# Altium project SpaceVNXDaughterBoard.PrjPcb
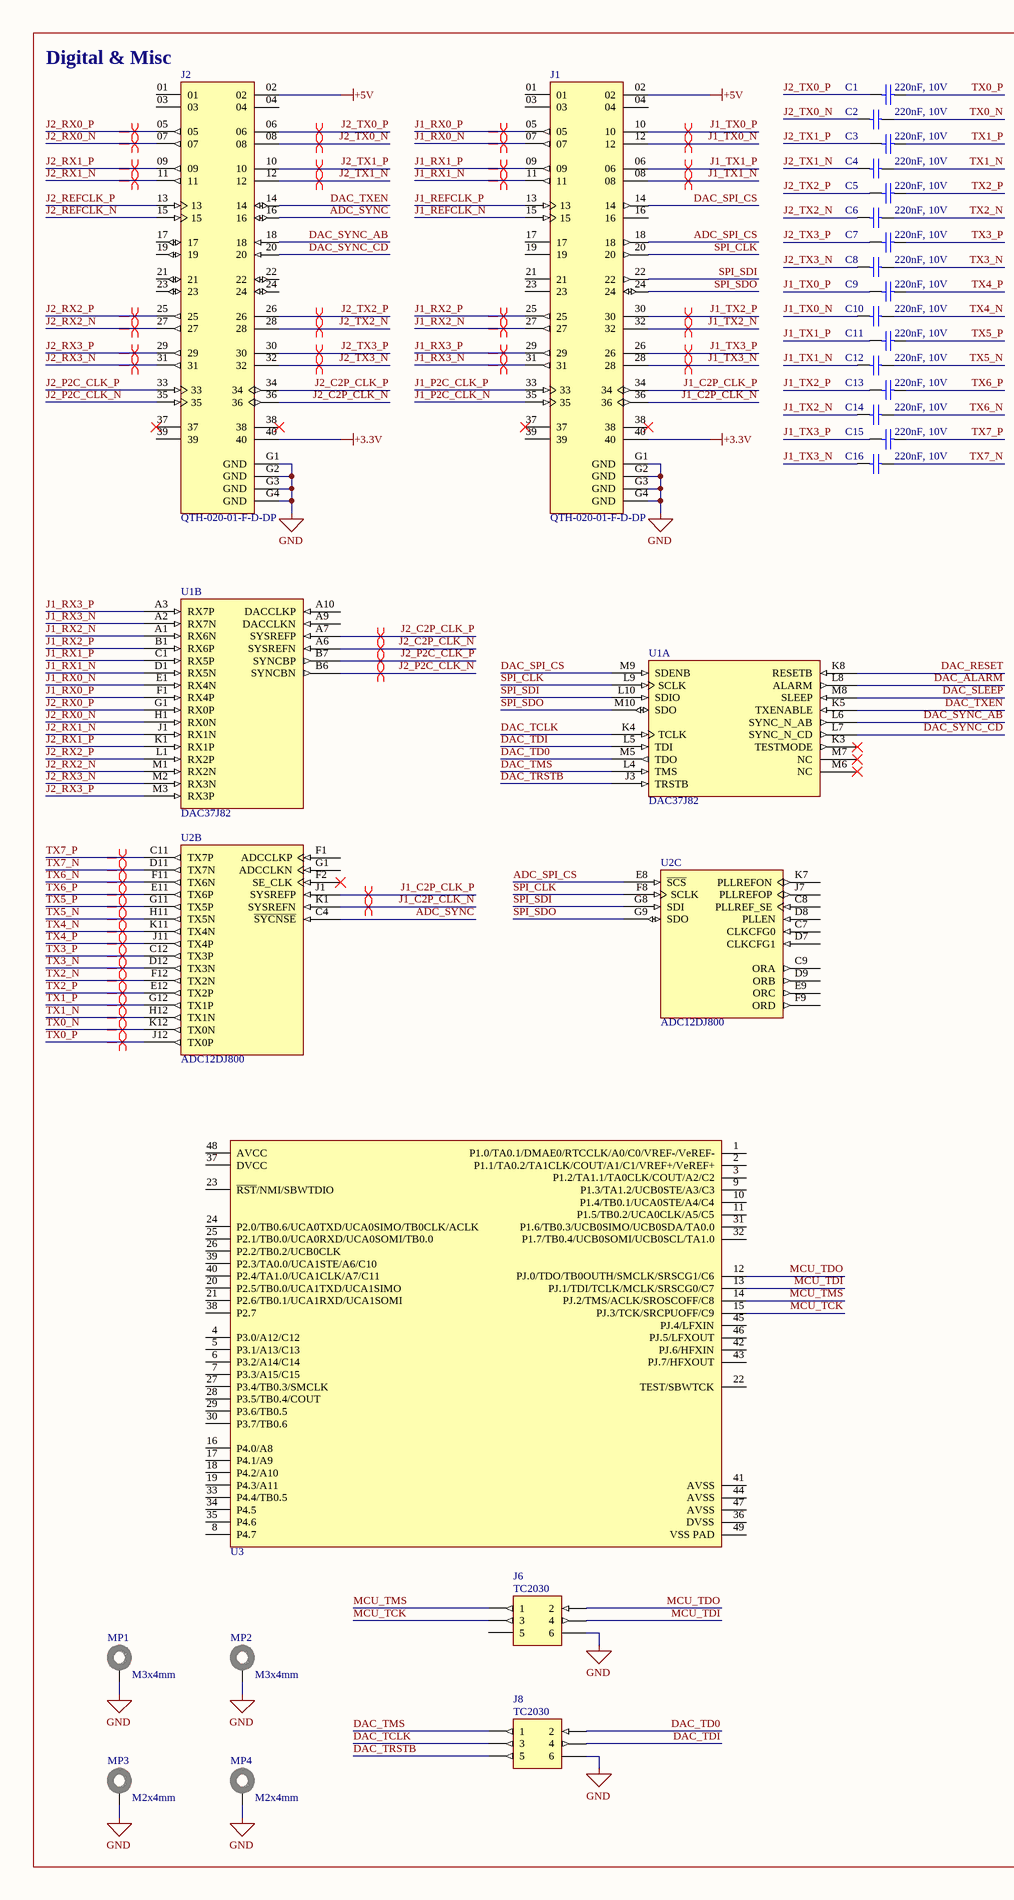
[diagram p0: SpaceVNXDaughterBoard.SchDoc, left]
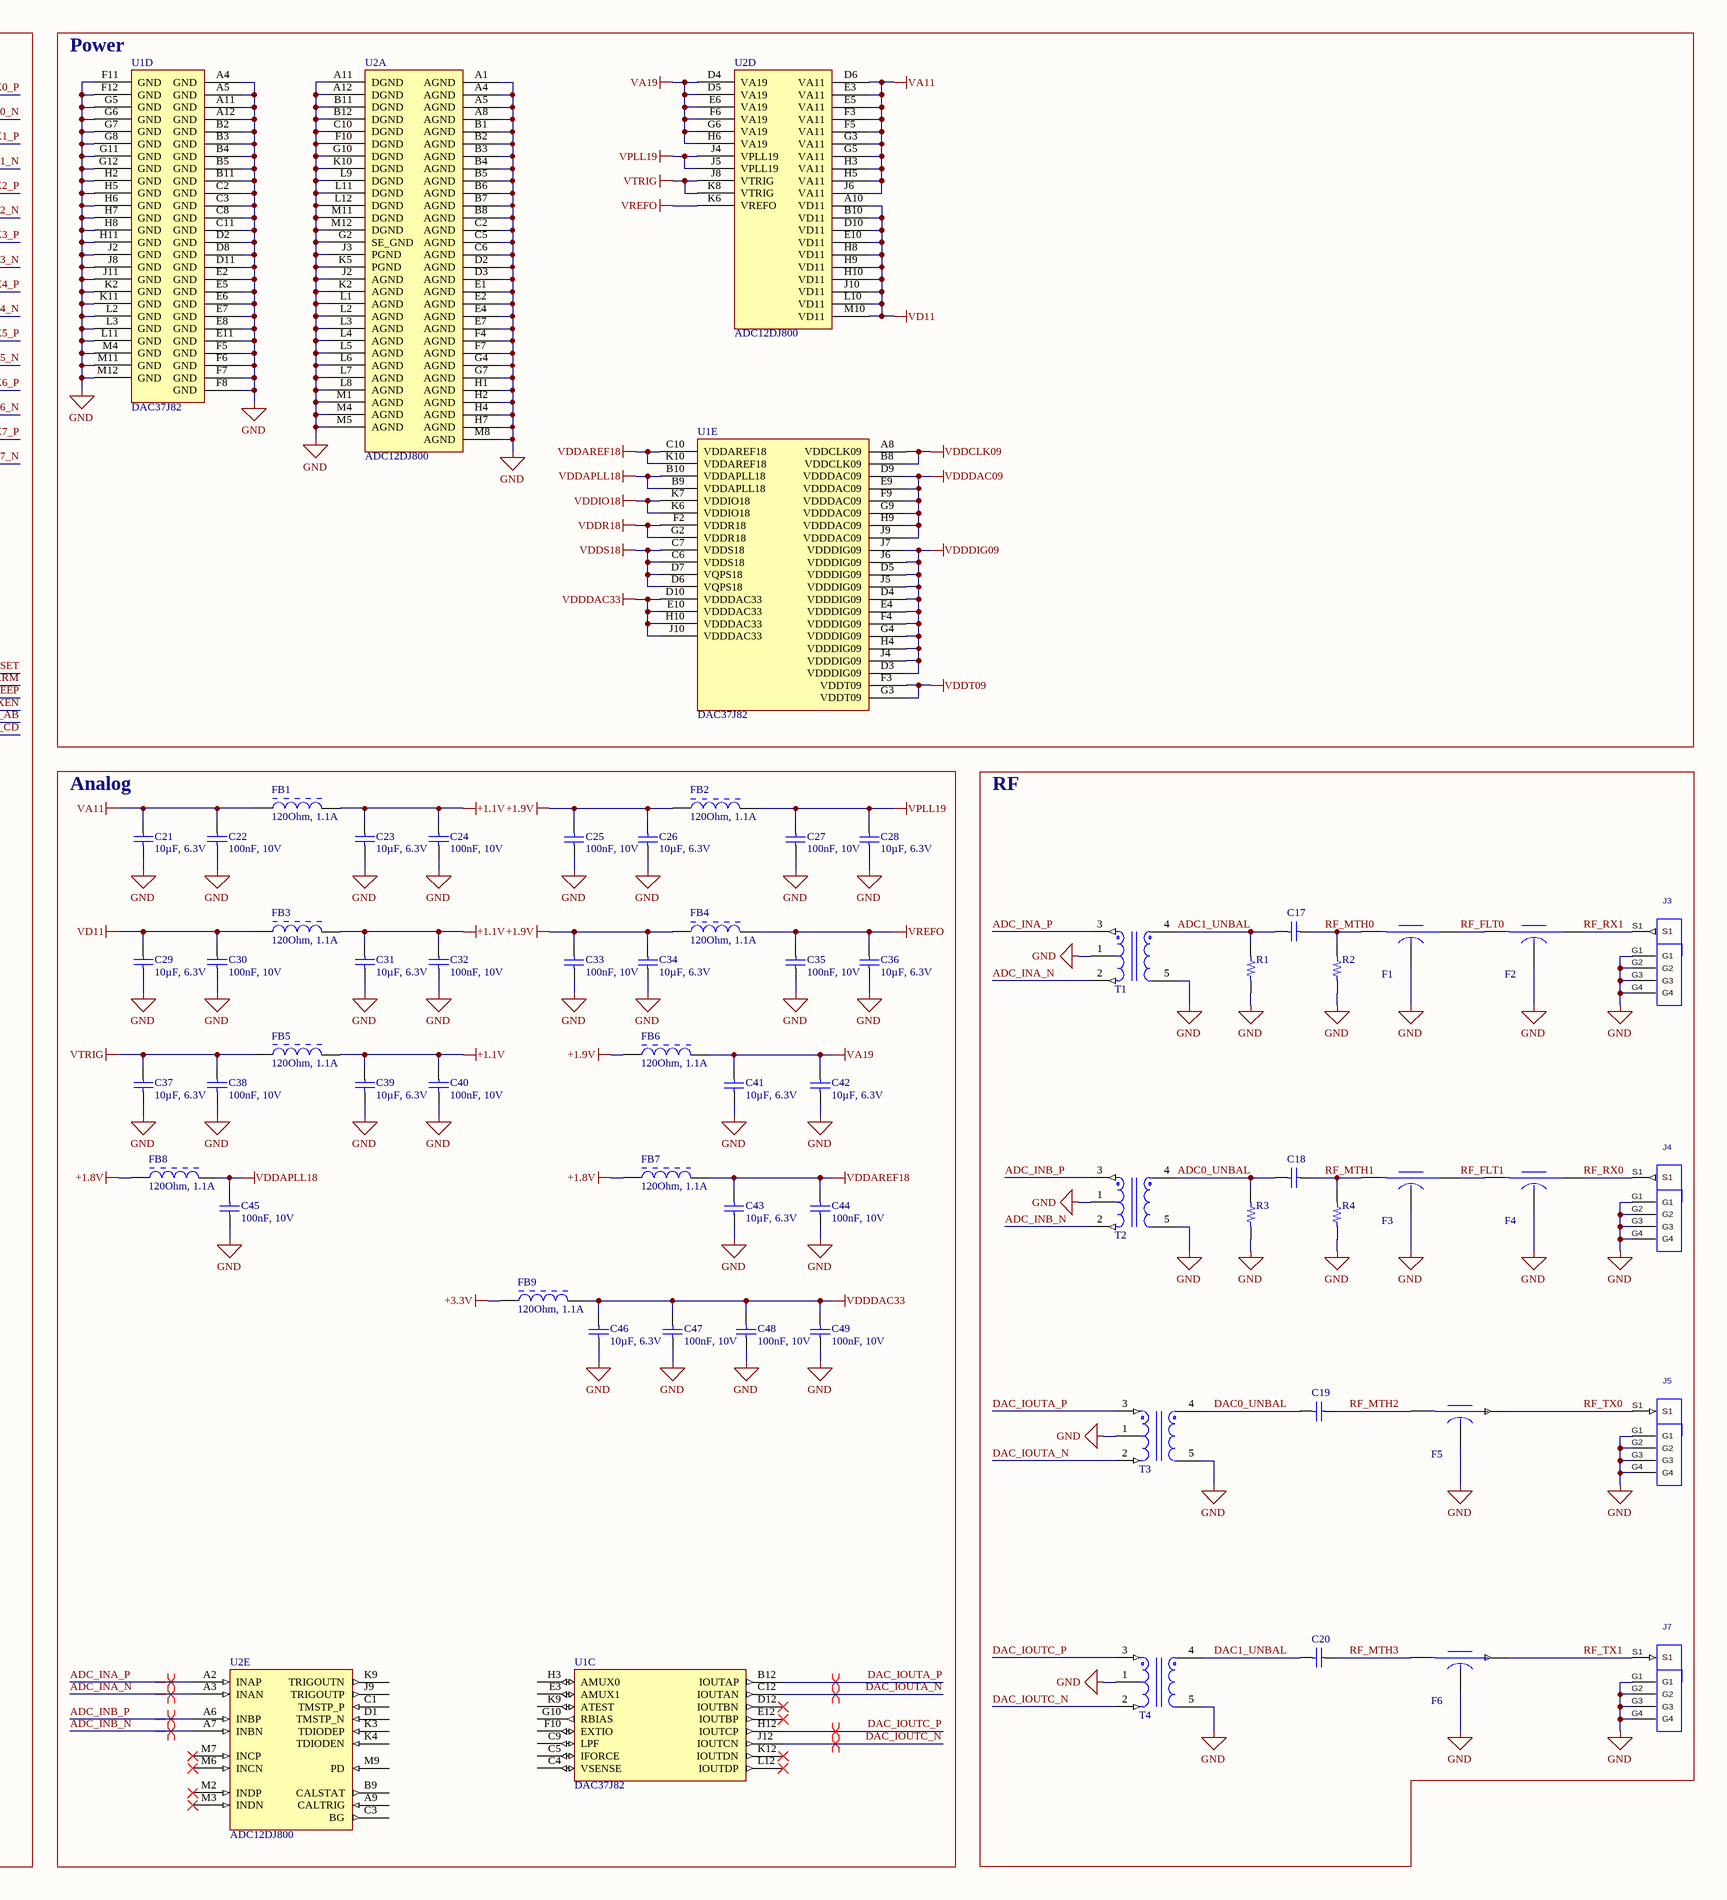
[diagram p1: SpaceVNXDaughterBoard.SchDoc, right]
1 sheet, 87 parts. Net scope: global (net labels, ports and power ports of the same name join across sheets).
Board file: SpaceVNXDaughterBoard.PcbDoc

## Sheet SpaceVNXDaughterBoard.SchDoc: DaughterBoard
size A2; Author: Carlos Barreiro; Organization: Escuela Técnica Superior de Ingeniería de Sistemas Informáticos de la Universidad Politécnica de Madrid; Address1: Campus Sur de la Universidad Politécnica de Madrid; Address2: Calle de Alan Turing, s/nº; Address3: Madrid 28031; Address4: España; DocumentNumber: 1; Revision: 1.0; SheetNumber: 1; SheetTotal: 1

### Parts
C1  220nF, 10V  [WURTH_WCAP-CSGP_0402]
C2  220nF, 10V  [WURTH_WCAP-CSGP_0402]
C3  220nF, 10V  [WURTH_WCAP-CSGP_0402]
C4  220nF, 10V  [WURTH_WCAP-CSGP_0402]
C5  220nF, 10V  [WURTH_WCAP-CSGP_0402]
C6  220nF, 10V  [WURTH_WCAP-CSGP_0402]
C7  220nF, 10V  [WURTH_WCAP-CSGP_0402]
C8  220nF, 10V  [WURTH_WCAP-CSGP_0402]
C9  220nF, 10V  [WURTH_WCAP-CSGP_0402]
C10  220nF, 10V  [WURTH_WCAP-CSGP_0402]
C11  220nF, 10V  [WURTH_WCAP-CSGP_0402]
C12  220nF, 10V  [WURTH_WCAP-CSGP_0402]
C13  220nF, 10V  [WURTH_WCAP-CSGP_0402]
C14  220nF, 10V  [WURTH_WCAP-CSGP_0402]
C15  220nF, 10V  [WURTH_WCAP-CSGP_0402]
C16  220nF, 10V  [WURTH_WCAP-CSGP_0402]
C17  10pF, 16V  [WURTH_WCAP-CSGP_0402]  (value not drawn)
C18  10pF, 16V  [WURTH_WCAP-CSGP_0402]  (value not drawn)
C19  10pF, 16V  [WURTH_WCAP-CSGP_0402]  (value not drawn)
C20  10pF, 16V  [WURTH_WCAP-CSGP_0402]  (value not drawn)
C21  10µF, 6.3V  [WURTH_WCAP-CSGP_0402]
C22  100nF, 10V  [WURTH_WCAP-CSGP_0402]
C23  10µF, 6.3V  [WURTH_WCAP-CSGP_0402]
C24  100nF, 10V  [WURTH_WCAP-CSGP_0402]
C25  100nF, 10V  [WURTH_WCAP-CSGP_0402]
C26  10µF, 6.3V  [WURTH_WCAP-CSGP_0402]
C27  100nF, 10V  [WURTH_WCAP-CSGP_0402]
C28  10µF, 6.3V  [WURTH_WCAP-CSGP_0402]
C29  10µF, 6.3V  [WURTH_WCAP-CSGP_0402]
C30  100nF, 10V  [WURTH_WCAP-CSGP_0402]
C31  10µF, 6.3V  [WURTH_WCAP-CSGP_0402]
C32  100nF, 10V  [WURTH_WCAP-CSGP_0402]
C33  100nF, 10V  [WURTH_WCAP-CSGP_0402]
C34  10µF, 6.3V  [WURTH_WCAP-CSGP_0402]
C35  100nF, 10V  [WURTH_WCAP-CSGP_0402]
C36  10µF, 6.3V  [WURTH_WCAP-CSGP_0402]
C37  10µF, 6.3V  [WURTH_WCAP-CSGP_0402]
C38  100nF, 10V  [WURTH_WCAP-CSGP_0402]
C39  10µF, 6.3V  [WURTH_WCAP-CSGP_0402]
C40  100nF, 10V  [WURTH_WCAP-CSGP_0402]
C41  10µF, 6.3V  [WURTH_WCAP-CSGP_0402]
C42  10µF, 6.3V  [WURTH_WCAP-CSGP_0402]
C43  10µF, 6.3V  [WURTH_WCAP-CSGP_0402]
C44  100nF, 10V  [WURTH_WCAP-CSGP_0402]
C45  100nF, 10V  [WURTH_WCAP-CSGP_0402]
C46  10µF, 6.3V  [WURTH_WCAP-CSGP_0402]
C47  100nF, 10V  [WURTH_WCAP-CSGP_0402]
C48  100nF, 10V  [WURTH_WCAP-CSGP_0402]
C49  100nF, 10V  [WURTH_WCAP-CSGP_0402]
F1  BFTC-XXXX+  [Mini-Circuits_FV1206]  (value not drawn)
F2  BFTC-XXXX+  [Mini-Circuits_FV1206]  (value not drawn)
F3  BFTC-XXXX+  [Mini-Circuits_FV1206]  (value not drawn)
F4  BFTC-XXXX+  [Mini-Circuits_FV1206]  (value not drawn)
F5  BFTC-XXXX+  [Mini-Circuits_FV1206]  (value not drawn)
F6  BFTC-XXXX+  [Mini-Circuits_FV1206]  (value not drawn)
FB1  120Ohm, 1.1A  [WURTH-CBF_0402]
FB2  120Ohm, 1.1A  [WURTH-CBF_0402]
FB3  120Ohm, 1.1A  [WURTH-CBF_0402]
FB4  120Ohm, 1.1A  [WURTH-CBF_0402]
FB5  120Ohm, 1.1A  [WURTH-CBF_0402]
FB6  120Ohm, 1.1A  [WURTH-CBF_0402]
FB7  120Ohm, 1.1A  [WURTH-CBF_0402]
FB8  120Ohm, 1.1A  [WURTH-CBF_0402]
FB9  120Ohm, 1.1A  [WURTH-CBF_0402]
J1  QTH-020-01-F-D-DP  [SAMTEC_QTH-020-01-X-D-DP-A]
J2  QTH-020-01-F-D-DP  [SAMTEC_QTH-020-01-X-D-DP-A]
J3  MMCX-J-P-X-ST-SM1  [MMCX-J-P-X-ST-SM1]  (value not drawn)
J4  MMCX-J-P-X-ST-SM1  [MMCX-J-P-X-ST-SM1]  (value not drawn)
J5  MMCX-J-P-X-ST-SM1  [MMCX-J-P-X-ST-SM1]  (value not drawn)
J6  TC2030  [TC2030-DUAL]
J7  MMCX-J-P-X-ST-SM1  [MMCX-J-P-X-ST-SM1]  (value not drawn)
J8  TC2030  [TC2030-DUAL]
MP1  M3x4mm  [90910A572]
MP2  M3x4mm  [90910A572]
MP3  M2x4mm  [90910A572]
MP4  M2x4mm  [90910A572]
R1  100 Ω  [PANASONIC_ERJ2G_0402]  (value not drawn)
R2  100 Ω  [PANASONIC_ERJ2G_0402]  (value not drawn)
R3  100 Ω  [PANASONIC_ERJ2G_0402]  (value not drawn)
R4  100 Ω  [PANASONIC_ERJ2G_0402]  (value not drawn)
T1  ETC1-1T-2TR  [MA-COM_ETC1-1T-2TR]  (value not drawn)
T2  ETC1-1T-2TR  [MA-COM_ETC1-1T-2TR]  (value not drawn)
T3  ETC1-1T-2TR  [MA-COM_ETC1-1T-2TR]  (value not drawn)
T4  ETC1-1T-2TR  [MA-COM_ETC1-1T-2TR]  (value not drawn)
U1  DAC37J82  [TEXAS_FCBGA144]  (parts A,B,C,D,E of 5)
U2  ADC12DJ800  [TEXAS_FCBGA144]  (parts A,B,C,D,E of 5)
U3  MSP430FR5969IRGZR  [TEXAS_VQFN48]  (value not drawn)

### Blocks framed on the sheet
Digital & Misc: C1-C16 J1 J2 J6 J8 MP1-MP4 U1-U3
Power: U1 U2
Analog: C21-C49 FB1-FB9 U1 U2
RF: C17-C20 F1-F6 J3-J5 J7 R1-R4 T1-T4

### Nets
+1.1V: C23.2 C24.2 C31.2 C32.2 C39.2 C40.2 FB1.1 FB3.1 FB5.1
+1.8V: FB7.1 FB8.1
+1.9V: C25.2 C26.2 C33.2 C34.2 FB2.1 FB4.1 FB6.1
+3.3V: FB9.1 J1.40 J2.40
+5V: J1.02 J2.02
GND: C21.1 C22.1 C23.1 C24.1 C25.1 C26.1 C27.1 C28.1 C29.1 C30.1 C31.1 C32.1 C33.1 C34.1 C35.1 C36.1 C37.1 C38.1 C39.1 C40.1 C41.1 C42.1 C43.1 C44.1 C45.1 C46.1 C47.1 C48.1 C49.1 F1.2(GND) F2.2(GND) F3.2(GND) F4.2(GND) F5.2(GND) F6.2(GND) J1.G1(GND) J1.G2(GND) J1.G3(GND) J1.G4(GND) J2.G1(GND) J2.G2(GND) J2.G3(GND) J2.G4(GND) J3.G1 J3.G2 J3.G3 J3.G4 J4.G1 J4.G2 J4.G3 J4.G4 J5.G1 J5.G2 J5.G3 J5.G4 J6.6 J7.G1 J7.G2 J7.G3 J7.G4 J8.6 MP1.1 MP2.1 MP3.1 MP4.1 R1.1 R2.1 R3.1 R4.1 T1.1(Secondary) T1.5(Primary) T2.1(Secondary) T2.5(Primary) T3.1(Secondary) T3.5(Primary) T4.1(Secondary) T4.5(Primary) U1.A4(GND) U1.A5(GND) U1.A11(GND) U1.A12(GND) U1.B2(GND) U1.B3(GND) U1.B4(GND) U1.B5(GND) U1.B11(GND) U1.C2(GND) U1.C3(GND) U1.C8(GND) U1.C11(GND) U1.D2(GND) U1.D8(GND) U1.D11(GND) U1.E2(GND) U1.E5(GND) U1.E6(GND) U1.E7(GND) U1.E8(GND) U1.E11(GND) U1.F5(GND) U1.F6(GND) U1.F7(GND) U1.F8(GND) U1.F11(GND) U1.F12(GND) U1.G5(GND) U1.G6(GND) U1.G7(GND) U1.G8(GND) U1.G11(GND) U1.G12(GND) U1.H2(GND) U1.H5(GND) U1.H6(GND) U1.H7(GND) U1.H8(GND) U1.H11(GND) U1.J2(GND) U1.J8(GND) U1.J11(GND) U1.K2(GND) U1.K11(GND) U1.L2(GND) U1.L3(GND) U1.L11(GND) U1.M4(GND) U1.M11(GND) U1.M12(GND) U2.A1(AGND) U2.A4(AGND) U2.A5(AGND) U2.A8(AGND) U2.A11(DGND) U2.A12(DGND) U2.B1(AGND) U2.B2(AGND) U2.B3(AGND) U2.B4(AGND) U2.B5(AGND) U2.B6(AGND) U2.B7(AGND) U2.B8(AGND) U2.B11(DGND) U2.B12(DGND) U2.C2(AGND) U2.C5(AGND) U2.C6(AGND) U2.C10(DGND) U2.D2(AGND) U2.D3(AGND) U2.E1(AGND) U2.E2(AGND) U2.E4(AGND) U2.E7(AGND) U2.F4(AGND) U2.F7(AGND) U2.F10(DGND) U2.G2(SE_GND) U2.G4(AGND) U2.G7(AGND) U2.G10(DGND) U2.H1(AGND) U2.H2(AGND) U2.H4(AGND) U2.H7(AGND) U2.J2(AGND) U2.J3(PGND) U2.K2(AGND) U2.K5(PGND) U2.K10(DGND) U2.L1(AGND) U2.L2(AGND) U2.L3(AGND) U2.L4(AGND) U2.L5(AGND) U2.L6(AGND) U2.L7(AGND) U2.L8(AGND) U2.L9(DGND) U2.L11(DGND) U2.L12(DGND) U2.M1(AGND) U2.M4(AGND) U2.M5(AGND) U2.M8(AGND) U2.M11(DGND) U2.M12(DGND)
VA11: C21.2 C22.2 FB1.2 U2.D6(VA11) U2.E3(VA11) U2.E5(VA11) U2.F3(VA11) U2.F5(VA11) U2.G3(VA11) U2.G5(VA11) U2.H3(VA11) U2.H5(VA11) U2.J6(VA11)
VA19: C41.2 C42.2 FB6.2 U2.D4(VA19) U2.D5(VA19) U2.E6(VA19) U2.F6(VA19) U2.G6(VA19) U2.H6(VA19)
VD11: C29.2 C30.2 FB3.2 U2.A10(VD11) U2.B10(VD11) U2.D10(VD11) U2.E10(VD11) U2.H8(VD11) U2.H9(VD11) U2.H10(VD11) U2.J10(VD11) U2.L10(VD11) U2.M10(VD11)
VDDAPLL18: C45.2 FB8.2 U1.B9(VDDAPLL18) U1.B10(VDDAPLL18)
VDDAREF18: C43.2 C44.2 FB7.2 U1.C10(VDDAREF18) U1.K10(VDDAREF18)
VDDCLK09: U1.A8(VDDCLK09) U1.B8(VDDCLK09)
VDDDAC09: U1.D9(VDDDAC09) U1.E9(VDDDAC09) U1.F9(VDDDAC09) U1.G9(VDDDAC09) U1.H9(VDDDAC09) U1.J9(VDDDAC09)
VDDDAC33: C46.2 C47.2 C48.2 C49.2 FB9.2 U1.D10(VDDDAC33) U1.E10(VDDDAC33) U1.H10(VDDDAC33) U1.J10(VDDDAC33)
VDDDIG09: U1.D3(VDDDIG09) U1.D4(VDDDIG09) U1.D5(VDDDIG09) U1.E4(VDDDIG09) U1.F4(VDDDIG09) U1.G4(VDDDIG09) U1.H4(VDDDIG09) U1.J4(VDDDIG09) U1.J5(VDDDIG09) U1.J6(VDDDIG09) U1.J7(VDDDIG09)
VDDIO18: U1.K6(VDDIO18) U1.K7(VDDIO18)
VDDR18: U1.F2(VDDR18) U1.G2(VDDR18)
VDDS18: U1.C6(VDDS18) U1.C7(VDDS18) U1.D6(VQPS18) U1.D7(VQPS18)
VDDT09: U1.F3(VDDT09) U1.G3(VDDT09)
VPLL19: C27.2 C28.2 FB2.2 U2.J4(VPLL19) U2.J5(VPLL19)
VREFO: C35.2 C36.2 FB4.2 U2.K6(VREFO)
VTRIG: C37.2 C38.2 FB5.2 U2.J8(VTRIG) U2.K8(VTRIG)
ADC0_UNBAL: C18.1 R3.2 T2.4(Primary_Dot)
ADC1_UNBAL: C17.1 R1.2 T1.4(Primary_Dot)
ADC_INA_N: T1.2(Secondary_CT) U2.A3(INAN)
ADC_INA_P: T1.3(Secondary_Dot) U2.A2(INAP)
ADC_INB_N: T2.2(Secondary_CT) U2.A7(INBN)
ADC_INB_P: T2.3(Secondary_Dot) U2.A6(INBP)
ADC_SPI_CS: J1.18 U2.E8(~{SCS})
ADC_SYNC: J2.16 U2.C4(~{SYCNSE})
DAC0_UNBAL: C19.1 T3.4(Primary_Dot)
DAC1_UNBAL: C20.1 T4.4(Primary_Dot)
DAC_ALARM: U1.L8(ALARM)
DAC_IOUTA_N: T3.2(Secondary_CT) U1.C12(IOUTAN)
DAC_IOUTA_P: T3.3(Secondary_Dot) U1.B12(IOUTAP)
DAC_IOUTC_N: T4.2(Secondary_CT) U1.J12(IOUTCN)
DAC_IOUTC_P: T4.3(Secondary_Dot) U1.H12(IOUTCP)
DAC_RESET: U1.K8(RESETB)
DAC_SLEEP: U1.M8(SLEEP)
DAC_SPI_CS: J1.14 U1.M9(SDENB)
DAC_SYNC_AB: J2.18 U1.L6(SYNC_N_AB)
DAC_SYNC_CD: J2.20 U1.L7(SYNC_N_CD)
DAC_TCLK: J8.3 U1.K4(TCLK)
DAC_TD0: J8.2 U1.M5(TDO)
DAC_TDI: J8.4 U1.L5(TDI)
DAC_TMS: J8.1 U1.L4(TMS)
DAC_TRSTB: J8.5 U1.J3(TRSTB)
DAC_TXEN: J2.14 U1.K5(TXENABLE)
J1_C2P_CLK_N: J1.36 U2.K1(SYSREFN)
J1_C2P_CLK_P: J1.34 U2.J1(SYSREFP)
J1_P2C_CLK_N: J1.35
J1_P2C_CLK_P: J1.33
J1_REFCLK_N: J1.15
J1_REFCLK_P: J1.13
J1_RX0_N: J1.07 U1.E1(RX4N)
J1_RX0_P: J1.05 U1.F1(RX4P)
J1_RX1_N: J1.11 U1.D1(RX5N)
J1_RX1_P: J1.09 U1.C1(RX5P)
J1_RX2_N: J1.27 U1.A1(RX6N)
J1_RX2_P: J1.25 U1.B1(RX6P)
J1_RX3_N: J1.31 U1.A2(RX7N)
J1_RX3_P: J1.29 U1.A3(RX7P)
J1_TX0_N: C10.1 J1.12
J1_TX0_P: C9.1 J1.10
J1_TX1_N: C12.1 J1.08
J1_TX1_P: C11.1 J1.06
J1_TX2_N: C14.1 J1.32
J1_TX2_P: C13.1 J1.30
J1_TX3_N: C16.1 J1.28
J1_TX3_P: C15.1 J1.26
J2_C2P_CLK_N: J2.36 U1.A6(SYSREFN)
J2_C2P_CLK_P: J2.34 U1.A7(SYSREFP)
J2_P2C_CLK_N: J2.35 U1.B6(SYNCBN)
J2_P2C_CLK_P: J2.33 U1.B7(SYNCBP)
J2_REFCLK_N: J2.15
J2_REFCLK_P: J2.13
J2_RX0_N: J2.07 U1.H1(RX0N)
J2_RX0_P: J2.05 U1.G1(RX0P)
J2_RX1_N: J2.11 U1.J1(RX1N)
J2_RX1_P: J2.09 U1.K1(RX1P)
J2_RX2_N: J2.27 U1.M1(RX2N)
J2_RX2_P: J2.25 U1.L1(RX2P)
J2_RX3_N: J2.31 U1.M2(RX3N)
J2_RX3_P: J2.29 U1.M3(RX3P)
J2_TX0_N: C2.1 J2.08
J2_TX0_P: C1.1 J2.06
J2_TX1_N: C4.1 J2.12
J2_TX1_P: C3.1 J2.10
J2_TX2_N: C6.1 J2.28
J2_TX2_P: C5.1 J2.26
J2_TX3_N: C8.1 J2.32
J2_TX3_P: C7.1 J2.30
MCU_TCK: J6.3 U3.15(PJ.3/TCK/SRCPUOFF/C9)
MCU_TDI: J6.4 U3.13(PJ.1/TDI/TCLK/MCLK/SRSCG0/C7)
MCU_TDO: J6.2 U3.12(PJ.0/TDO/TB0OUTH/SMCLK/SRSCG1/C6)
MCU_TMS: J6.1 U3.14(PJ.2/TMS/ACLK/SROSCOFF/C8)
RF_FLT0: F1.3(Output) F2.1(Input)
RF_FLT1: F3.3(Output) F4.1(Input)
RF_MTH0: C17.2 F1.1(Input) R2.2
RF_MTH1: C18.2 F3.1(Input) R4.2
RF_MTH2: C19.2 F5.1(Input)
RF_MTH3: C20.2 F6.1(Input)
RF_RX0: F4.3(Output) J4.S1
RF_RX1: F2.3(Output) J3.S1
RF_TX0: F5.3(Output) J5.S1
RF_TX1: F6.3(Output) J7.S1
SPI_CLK: J1.20 U1.L9(SCLK) U2.F8(SCLK)
SPI_SDI: J1.22 U1.L10(SDIO) U2.G8(SDI)
SPI_SDO: J1.24 U1.M10(SDO) U2.G9(SDO)
TX0_N: C2.2 U2.K12(TX0N)
TX0_P: C1.2 U2.J12(TX0P)
TX1_N: C4.2 U2.H12(TX1N)
TX1_P: C3.2 U2.G12(TX1P)
TX2_N: C6.2 U2.F12(TX2N)
TX2_P: C5.2 U2.E12(TX2P)
TX3_N: C8.2 U2.D12(TX3N)
TX3_P: C7.2 U2.C12(TX3P)
TX4_N: C10.2 U2.K11(TX4N)
TX4_P: C9.2 U2.J11(TX4P)
TX5_N: C12.2 U2.H11(TX5N)
TX5_P: C11.2 U2.G11(TX5P)
TX6_N: C14.2 U2.F11(TX6N)
TX6_P: C13.2 U2.E11(TX6P)
TX7_N: C16.2 U2.D11(TX7N)
TX7_P: C15.2 U2.C11(TX7P)

Not connected (* = marked no-connect by the designer): J1 01 03 04 16 17 19 21 23 37* 38* 39; J2 01 03 04 17 19 21 22 23 24 37* 38* 39; J6 5; U1 A9(DACCLKN) A10(DACCLKP) C4(VSENSE) C5(IFORCE) C9(LPF) D12(IOUTBN)* E3(AMUX1) E12(IOUTBP)* F10(EXTIO) G10(RBIAS) H3(AMUX0) K3(TESTMODE)* K9(ATEST) K12(IOUTDN)* L12(IOUTDP)* M6(NC)* M7(NC)*; U2 A9(CALTRIG) B9(CALSTAT) C1(TMSTP_P) C3(BG) C7(CLKCFG0) C8(PLLREF_SE) C9(ORA) D1(TMSTP_N) D7(CLKCFG1) D8(PLLEN) D9(ORB) E9(ORC) F1(ADCCLKP) F2(SE_CLK)* F9(ORD) G1(ADCCLKN) J7(PLLREFOP) J9(TRIGOUTP) K3(TDIODEP) K4(TDIODEN) K7(PLLREFON) K9(TRIGOUTN) M2(INDP)* M3(INDN)* M6(INCN)* M7(INCP)* M9(PD); U3 1(P1.0/TA0.1/DMAE0/RTCCLK/A0/C0/VREF-/VeREF-) 2(P1.1/TA0.2/TA1CLK/COUT/A1/C1/VREF+/VeREF+) 3(P1.2/TA1.1/TA0CLK/COUT/A2/C2) 4(P3.0/A12/C12) 5(P3.1/A13/C13) 6(P3.2/A14/C14) 7(P3.3/A15/C15) 8(P4.7) 9(P1.3/TA1.2/UCB0STE/A3/C3) 10(P1.4/TB0.1/UCA0STE/A4/C4) 11(P1.5/TB0.2/UCA0CLK/A5/C5) 16(P4.0/A8) 17(P4.1/A9) 18(P4.2/A10) 19(P4.3/A11) 20(P2.5/TB0.0/UCA1TXD/UCA1SIMO) 21(P2.6/TB0.1/UCA1RXD/UCA1SOMI) 22(TEST/SBWTCK) 23(~{RST}/NMI/SBWTDIO) 24(P2.0/TB0.6/UCA0TXD/UCA0SIMO/TB0CLK/ACLK) 25(P2.1/TB0.0/UCA0RXD/UCA0SOMI/TB0.0) 26(P2.2/TB0.2/UCB0CLK) 27(P3.4/TB0.3/SMCLK) 28(P3.5/TB0.4/COUT) 29(P3.6/TB0.5) 30(P3.7/TB0.6) 31(P1.6/TB0.3/UCB0SIMO/UCB0SDA/TA0.0) 32(P1.7/TB0.4/UCB0SOMI/UCB0SCL/TA1.0) 33(P4.4/TB0.5) 34(P4.5) 35(P4.6) 36(DVSS) 37(DVCC) 38(P2.7) 39(P2.3/TA0.0/UCA1STE/A6/C10) 40(P2.4/TA1.0/UCA1CLK/A7/C11) 41(AVSS) 42(PJ.6/HFXIN) 43(PJ.7/HFXOUT) 44(AVSS) 45(PJ.4/LFXIN) 46(PJ.5/LFXOUT) 47(AVSS) 48(AVCC) 49(VSS_PAD)

### Layout directives
differential pair: ADC_INA_N, ADC_INA_P, ADC_INB_N, ADC_INB_P, DAC_IOUTA_N, DAC_IOUTA_P, DAC_IOUTC_N, DAC_IOUTC_P, J1_C2P_CLK_N, J1_C2P_CLK_P, J1_RX0_N, J1_RX0_P, J1_RX1_N, J1_RX1_P, J1_RX2_N, J1_RX2_P, J1_RX3_N, J1_RX3_P, J1_TX0_N, J1_TX0_P, J1_TX1_N, J1_TX1_P, J1_TX2_N, J1_TX2_P, J1_TX3_N, J1_TX3_P, J2_C2P_CLK_N, J2_C2P_CLK_P, J2_P2C_CLK_N, J2_P2C_CLK_P, J2_RX0_N, J2_RX0_P, J2_RX1_N, J2_RX1_P, J2_RX2_N, J2_RX2_P, J2_RX3_N, J2_RX3_P, J2_TX0_N, J2_TX0_P, J2_TX1_N, J2_TX1_P, J2_TX2_N, J2_TX2_P, J2_TX3_N, J2_TX3_P, TX0_N, TX0_P, TX1_N, TX1_P, TX2_N, TX2_P, TX3_N, TX3_P, TX4_N, TX4_P, TX5_N, TX5_P, TX6_N, TX6_P, TX7_N, TX7_P

### Notes on the sheet
- Project:
- Title:
- Date:
- Designer:
- Commit:
- Sheet
- Revision:
- of

### Library data of the parts
C1-C16 = 885012105011: WCAP-CSGP Multilayer Ceramic Chip Capacitor, General Purpose, size 0402, X5R, 220nF, 10V; Manufacturer: Wurth Elektronik; Rated Voltage: 10VDC; Isolation Resistance  min.: 2.3GOhm; Capacitance Tolerance: +/-20%; Dissipation Factor max.: 5%; Technical Reference: X5R0402224M010DFCT10000; ComponentLink1Description: Manufacturer; ComponentLink1URL: http://www.we-online.de; ComponentLink2Description: Datasheet; ComponentLink2URL: https://www.we-online.com/catalog/datasheet/885012105011.pdf; Operating Temperature: -55 to +85degC; Packaging: Tape and Reel; Manufacturer Part Number: 885012105011; Published Date: April 2021; Ceramic Type: X5R; Height: 0.5mm; Mounting Technology: SMT; Size: 0402; Capacitance: 220nF; Q-Factor min.: -
C17-C20 = 885012005025: WCAP-CSGP Multilayer Ceramic Chip Capacitor, General Purpose, size 0402, NP0, 10pF, 16V; Manufacturer: Wurth Elektronik; Rated Voltage: 16VDC; Isolation Resistance  min.: 10GOhm; Capacitance Tolerance: +/-5%; Technical Reference: NP00402100J016DFCT10000; Q-Factor min.: 400+20C; ComponentLink1Description: Manufacturer; ComponentLink1URL: http://www.we-online.de; ComponentLink2Description: Datasheet; ComponentLink2URL: https://www.we-online.com/catalog/datasheet/885012005025.pdf; Operating Temperature: -55 to +125degC; Packaging: Tape and Reel; Manufacturer Part Number: 885012005025; Published Date: April 2021; Ceramic Type: NP0; Dissipation Factor max.: -; Height: 0.5mm; Mounting Technology: SMT; Size: 0402; Capacitance: 10pF
C21 C23 C26 C28 C29 C31 C34 C36 C37 C39 C41-C43 C46 = 885012105020: WCAP-CSGP Multilayer Ceramic Chip Capacitor, General Purpose, size 0402, X5R, 10uF, 6.3V; Manufacturer: Wurth Elektronik; Rated Voltage: 6.3VDC; Isolation Resistance  min.: 0.01GOhm; Capacitance Tolerance: +/20%; Dissipation Factor max.: 10%; Technical Reference: X5R0402106M6R3DFCT10000; ComponentLink1Description: Manufacturer; ComponentLink1URL: http://www.we-online.de; ComponentLink2Description: Datasheet; ComponentLink2URL: https://www.we-online.com/catalog/datasheet/885012105020.pdf; Operating Temperature: -55 to +85degC; Packaging: Tape and Reel; Manufacturer Part Number: 885012105020; Published Date: April 2021; Ceramic Type: X5R; Height: 0.5mm; Mounting Technology: SMT; Size: 0402; Capacitance: 10uF; Q-Factor min.: -
C22 C24 C25 C27 C30 C32 C33 C35 C38 C40 C44 C45 C47-C49 = 885012205018: WCAP-CSGP Multilayer Ceramic Chip Capacitor, General Purpose, size 0402, X7R, 100nF, 10V; Manufacturer: Wurth Elektronik; Rated Voltage: 10VDC; Isolation Resistance  min.: 5GOhm; Capacitance Tolerance: +/-10%; Dissipation Factor max.: 5%; Technical Reference: X7R0402104K010DFCT10000; ComponentLink1Description: Manufacturer; ComponentLink1URL: http://www.we-online.de; ComponentLink2Description: Datasheet; ComponentLink2URL: https://www.we-online.com/catalog/datasheet/885012205018.pdf; Operating Temperature: -55 to +125degC; Packaging: Tape and Reel; Manufacturer Part Number: 885012205018; Published Date: April 2021; Ceramic Type: X7R; Height: 0.5mm; Mounting Technology: SMT; Size: 0402; Capacitance: 100nF; Q-Factor min.: -
F1-F6 = BFTC-XXXX+: Band Pass RF Filter; Manufacturer: Mini-Circuits; Case Style: FV1206; Rejection (dB): 20; Impedance: 50Ω; Body Size: 3.2mm x 1.6mm; Technology: LTCC; ComponentLink1Description: Manufacturer; ComponentLink1URL: https://www.minicircuits.com/WebStore/RF-Filters.html; Supplier 1: Mouser; Supplier 2: Digi-Key; Supplier Part Number 1: 139-BFCN-1860; Supplier Part Number 2: 3157-BFCN-1860+CT-ND; ComponentLink2Description: Case Style; ComponentLink2URL: https://www.minicircuits.com/case_style/FV1206.pdf; ComponentLink3Description: Sugested Mounting Configuration; ComponentLink3URL: https://www.minicircuits.com/pcb/98-pl137.pdf
FB1-FB9 = 74279271: WE-CBF SMT EMI Suppression Ferrite Bead, size 0402, 120Ohm, 1.1A; Manufacturer: Wurth Elektronik; Impedance max.: 200Ohm; DC Resistance max.: 0.2Ohm; Type: Wide Band; ComponentLink1Description: Manufacturer; ComponentLink1URL: http://www.we-online.de; ComponentLink2Description: Datasheet; ComponentLink2URL: https://www.we-online.com/catalog/datasheet/74279271.pdf; Operating Temperature: -55 to +125degC; Packaging: Tape and Reel; Published Date: December 2021; Rated Current: 1.1A; Manufacturer Part Number: 74279271; Impedance @100MHz: 120Ohm; Mounting Technology: SMT; Size: 0402; Height: 0.5mm; Length: 1mm; Width: 0.5mm
J1 J2 = QTH-020-01-F-D-DP: 0.50 mm Q Pairs® High-Speed Ground Plane Terminal Strip, Differential Pair; MF: Samtec; System: Connector; MP: QTH-020-01-F-D-DP; ComponentLink1Description: MF; ComponentLink1URL: https://www.samtec.com/products/qth-dp; Supplier 1: Digi-Key; Supplier 2: Mouser; Supplier Part Number 2: 200-QTH02001FDDP; Supplier Part Number 1: QTH-020-01-F-D-DP-ND
J3-J5 J7 = MMCX-J-P-X-ST-SM1: 50 Ω MMCX up to 6 GHz /; Manufacturer: Samtec; Max. Frequency: 6 GHz; Impedance: 50Ω; Gender: Jack; Orientation: Straight; Termination: Surface Mount
J6 J8 = TC2030: Tag-Connect 6-pin Plug-of-Nails spring-pin cable footprint; Manufacturer_PN: TC2030-IDC; Manufacturer: Tag-Connect
MP1 MP2 = 90910A572: Button Head Torx Screws 18-8 Stainless Steel, M3 x 0.5 mm Thread, 4 mm Long; ComponentLink1Description: Manufacturer; ComponentLink1URL: https://www.mcmaster.com/90910A572/
MP3 MP4 = 90910A920: Button Head Torx Screws 18-8 Stainless Steel, M2 x 0.4mm Thread, 4mm Long; ComponentLink1Description: Manufacturer; ComponentLink1URL: https://www.mcmaster.com/90910A920/
R1-R4 = ERJ2GEJ101X: General Purpose Thick Film Chip Resistors; Manufacturer: Panasonic; Power (0402): 0.1 W; Limiting Voltage (0402): 50; Maximum Voltage (0402): 100; Resistance Range (Ω): 1Ω to 100MΩ; AEC 200: Grade 0; Size (0402): 2GE; ComponentLink1Description: Catalog; ComponentLink1URL: https://industrial.panasonic.com/ww/products/pt/general-purpose-chip-resistors/models?op=search&model_status_current=1&page=0#model-list-search-results; Series: ERJ; Temperature Range (ºC): -55 to +155; Supplier 1: Digi-Key; Supplier 2: Mouser; Supplier Part Number 2: 667-ERJ-2GEJ101X; Supplier Part Number 1: P100JTR-ND
T1-T4 = ETC1-1T-2TR: 1:1 Flux Coupled Balun 0.1-200MHz; Frequency Range: 100 kHz to 200 MHz; Primary Impedance: 50 Ohms; Maximum DC Current: 30 mA; Power Rating: 250 mW (1/4 W); Type: RF transformer; Package: SM-22-5; ComponentLink1Description: Manufacturer; ComponentLink1URL: https://www.macom.com/products/product-detail/ETC1-1T-2TR; Supplier 1: Mouser; Supplier 2: Digi-Key; Supplier Part Number 1: 937-ETC1-1T-2; Supplier Part Number 2: ETC1-1T-2TR-ND
U1 = DAC37J82: Dual-Channel, 16-Bit, 1.6/2.5 GSPS, Digital-to-Analog Converter with 12.5 Gbps JESD204B Interface.; Resolution (Bits): 16; Number of DAC channels (#): 2; Sample/update rate (MSPS): 1600; Rating: Catalog; Interpolation: 16x, 1x, 2x, 4x, 8x; Power consumption (Typ) (mW): 789; SFDR (dB): 81; Architecture: Current Source; Reference type: Internal; Interface type: JESD204B; Operating temperature range (C): -40ºC to 85ºC; ComponentLink1Description: Manufacturer; ComponentLink1URL: https://www.ti.com/product/DAC37J82?utm_source=google&utm_medium=cpc&utm_campaign=asc-null-null-GPN_EN-cpc-pf-google-wwe&utm_content=DAC37J82&ds_k=DAC37J82&DCM=yes&gclid=Cj0KCQjwgYSTBhDKARIsAB8Kukuy5g6TyeX5f3mFZCn5sLi-sPSUjPmCm8keN_PwoqNiLrqoEt2qAw0aArvDEALw_wcB&gclsrc=aw.ds#pps; Supplier 1: Mouser; Supplier 2: Digi-Key; Supplier Part Number 1: 595-DAC37J82IAAV; Supplier Part Number 2: 296-43411-ND
U2 = ADC12DJ800: Dual-Channel, 12-bit, 800-MSPS Analog-to-Digital Converter with JESD204C interface.; Resolution (Bits): 12; Number of ADC channels (#): 2; Sample rate (Max) (MSPS): 800; Rating: Automotive; Interface type: JESD204B, JESD204C; Analog input BW (MHz): 6000; Architecture: Folding Interpolating; SNR (dB): 57.6; Power consumption (Typ) (mW): 1110; Operating temperature range (ºC): -40ºC to 125ºC; ComponentLink1Description: Manufacturer; ComponentLink1URL: https://www.ti.com/product/ADC12DJ800-Q1; Supplier 1: Mouser; Supplier 2: Digi-Key; Supplier Part Number 1: 595-ADC12DJ2700AAV; Supplier Part Number 2: 296-48320-ND
U3 = MSP430FR5969IRGZR: MSP430™ FRAM Microcontroller IC 16-Bit 16MHz 64KB (64K x 8) FRAM 48-VQFN (7x7); Manufacturer: Texas Instruments; Num Pins: 48; ComponentLink2Description: Datasheet; Temperature: -40°C to +85°C; Package: RGZ (S-PVQFN-N48); Supplier 2: Mouser; Supplier 1: Digi-Key; ComponentLink1URL: https://upverter.com/upn/revision/0afe62f7510e28e0/; Supplier Part Number 2: 595-SP430FR5969IRGZR; Supplier Part Number 1: 296-37875-1-ND; ComponentLink1Description: Upverter; ComponentLink2URL: http://www.ti.com/lit/ds/symlink/msp430fr5969.pdf; Mouser Part Number: 595-SP430FR5969IRGZR